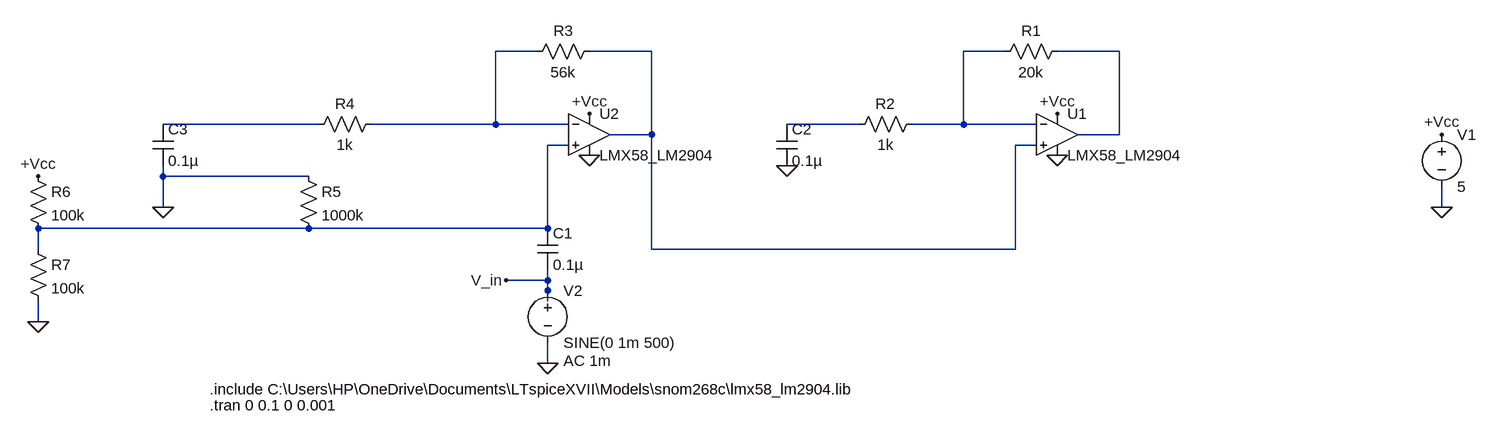
[diagram p0: schematic preamp_9.asc]
preamp_9.asc, the LTspice schematic file:
Version 4
SHEET 1 1480 680
WIRE 32 -224 -32 -224
WIRE 208 -224 112 -224
WIRE 752 -224 688 -224
WIRE 928 -224 832 -224
WIRE -304 -112 -544 -112
WIRE -32 -112 -32 -224
WIRE -32 -112 -224 -112
WIRE 80 -112 -32 -112
WIRE 528 -112 416 -112
WIRE 688 -112 688 -224
WIRE 688 -112 608 -112
WIRE 800 -112 688 -112
WIRE 208 -96 208 -224
WIRE 208 -96 144 -96
WIRE 928 -96 928 -224
WIRE 928 -96 864 -96
WIRE 80 -80 48 -80
WIRE 800 -80 768 -80
WIRE -544 -32 -544 -48
WIRE -320 -32 -544 -32
WIRE -544 16 -544 -32
WIRE 1424 16 1424 -16
WIRE -320 48 -736 48
WIRE 48 48 48 -80
WIRE 48 48 -320 48
WIRE -736 80 -736 48
WIRE 208 80 208 -96
WIRE 768 80 768 -80
WIRE 768 80 208 80
WIRE 48 128 48 112
WIRE 48 128 -16 128
WIRE 48 144 48 128
WIRE 48 160 48 144
WIRE -736 192 -736 160
WIRE 48 256 48 224
FLAG 1424 -96 +Vcc
FLAG 1424 16 0
FLAG 112 -128 +Vcc
FLAG 112 -64 0
FLAG -736 192 0
FLAG -736 -32 +Vcc
FLAG 48 256 0
FLAG -16 128 V_in
FLAG -544 16 0
FLAG 832 -128 +Vcc
FLAG 832 -64 0
FLAG 416 -48 0
SYMBOL voltage 1424 -112 R0
WINDOW 123 0 0 Left 0
WINDOW 39 0 0 Left 0
SYMATTR InstName V1
SYMATTR Value 5
SYMBOL OpAmps\\opamp2 112 -160 R0
SYMATTR InstName U2
SYMATTR Value LMX58_LM2904
SYMBOL res 128 -240 R90
WINDOW 0 0 56 VBottom 2
WINDOW 3 32 56 VTop 2
SYMATTR InstName R3
SYMATTR Value 56k
SYMBOL voltage 48 128 R0
WINDOW 123 24 124 Left 2
WINDOW 39 0 0 Left 0
SYMATTR Value2 AC 1m
SYMATTR InstName V2
SYMATTR Value SINE(0 1m 500)
SYMBOL res -208 -128 R90
WINDOW 0 0 56 VBottom 2
WINDOW 3 32 56 VTop 2
SYMATTR InstName R4
SYMATTR Value 1k
SYMBOL res -752 -48 R0
SYMATTR InstName R6
SYMATTR Value 100k
SYMBOL res -752 64 R0
SYMATTR InstName R7
SYMATTR Value 100k
SYMBOL cap 32 48 R0
SYMATTR InstName C1
SYMATTR Value 0.1µ
SYMBOL cap -560 -112 R0
SYMATTR InstName C3
SYMATTR Value 0.1µ
SYMBOL OpAmps\\opamp2 832 -160 R0
SYMATTR InstName U1
SYMATTR Value LMX58_LM2904
SYMBOL res 848 -240 R90
WINDOW 0 0 56 VBottom 2
WINDOW 3 32 56 VTop 2
SYMATTR InstName R1
SYMATTR Value 20k
SYMBOL res 624 -128 R90
WINDOW 0 0 56 VBottom 2
WINDOW 3 32 56 VTop 2
SYMATTR InstName R2
SYMATTR Value 1k
SYMBOL cap 400 -112 R0
SYMATTR InstName C2
SYMATTR Value 0.1µ
SYMBOL res -336 -48 R0
SYMATTR InstName R5
SYMATTR Value 1000k
TEXT -472 296 Left 2 !.include C:\\Users\\HP\\OneDrive\\Documents\\LTspiceXVII\\Models\\snom268c\\lmx58_lm2904.lib
TEXT -472 320 Left 2 !.tran 0 0.1 0 0.001

The netlist it stands for:
* preamp_9.asc
V1 +Vcc 0 5
XU2 N007 N001 +Vcc 0 N002 LMX58_LM2904  ; pins In+ In- V+ V- OUT
R3 N002 N001 56k
V2 V_in 0 SINE(0 1m 500) AC 1m
R4 N001 N005 1k
R6 +Vcc N007 100k
R7 N007 0 100k
C1 N007 V_in 0.1µ
C3 N005 0 0.1µ
XU1 N002 N003 +Vcc 0 N004 LMX58_LM2904  ; pins In+ In- V+ V- OUT
R1 N004 N003 20k
R2 N003 N006 1k
C2 N006 0 0.1µ
R5 0 N007 1000k
.include C:\Users\HP\OneDrive\Documents\LTspiceXVII\Models\snom268c\lmx58_lm2904.lib
.tran 0 0.1 0 0.001
.backanno
.end